# EAGLE design ALIMENTATION (EAGLE 8.5.1)
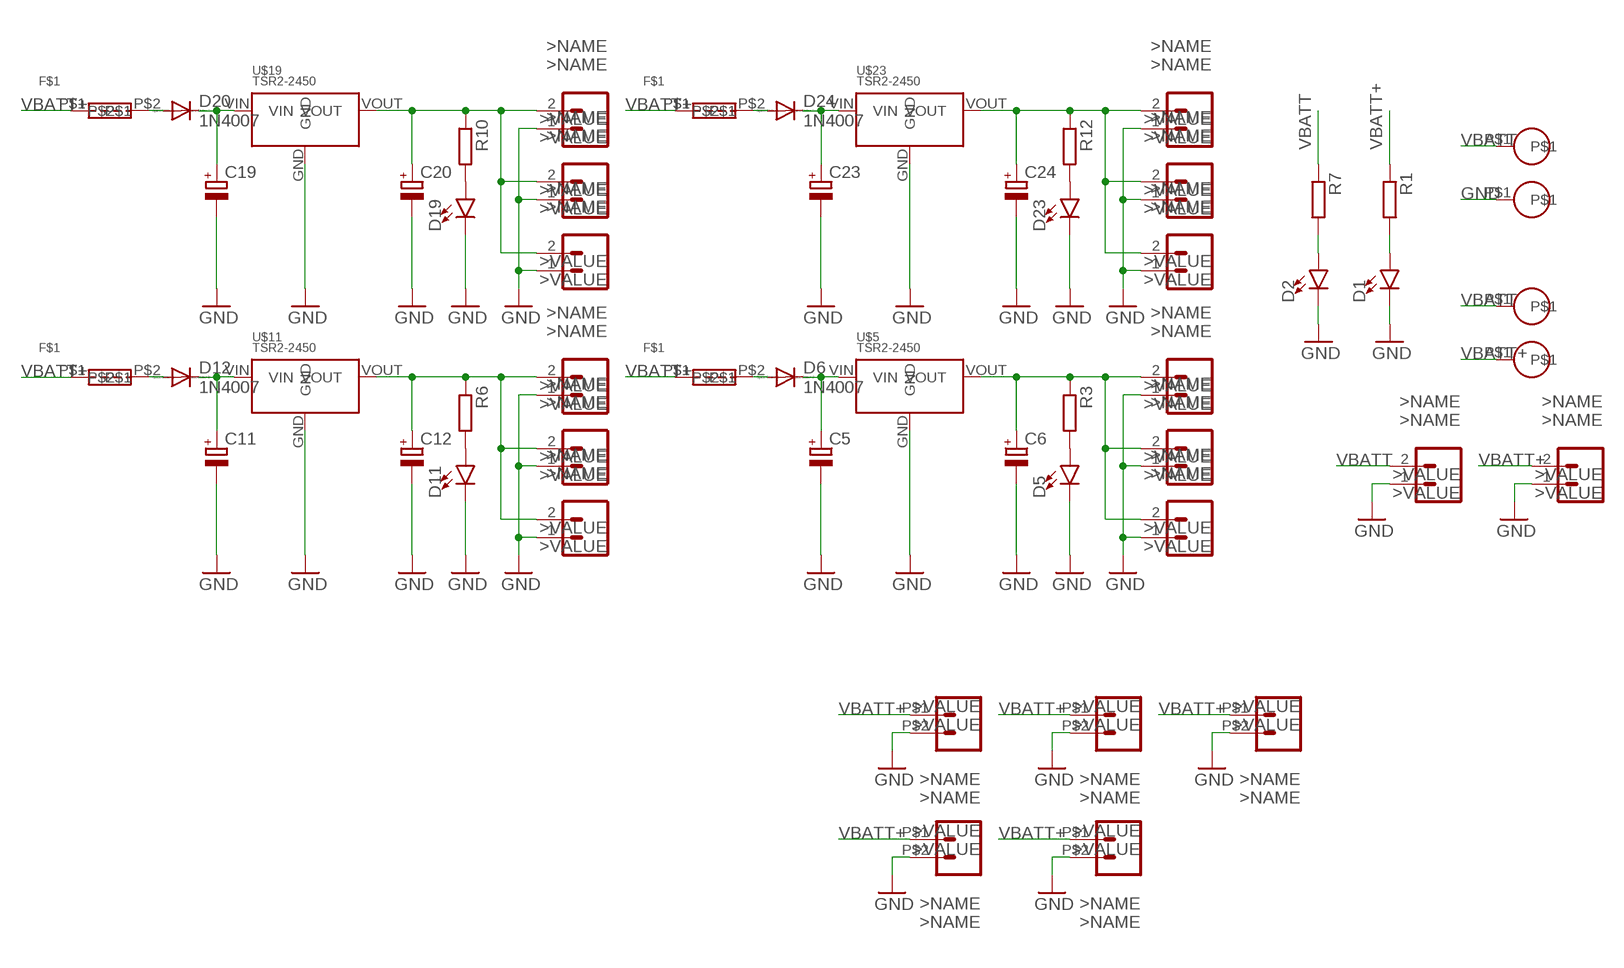
[diagram p0: schematic, sheet 1]

## Parts
C5  CPOL-EUE2-5  [E2-5]
C6  CPOL-EUE2-5  [E2-5]
C11  CPOL-EUE2-5  [E2-5]
C12  CPOL-EUE2-5  [E2-5]
C19  CPOL-EUE2-5  [E2-5]
C20  CPOL-EUE2-5  [E2-5]
C23  CPOL-EUE2-5  [E2-5]
C24  CPOL-EUE2-5  [E2-5]
D1  LED3MM  [LED_3MM]
D2  LED3MM  [LED_3MM]
D5  LED3MM  [LED_3MM]
D6  1N4007  1N4004  [DO41-10]
D11  LED3MM  [LED_3MM]
D12  1N4007  1N4004  [DO41-10]
D19  LED3MM  [LED_3MM]
D20  1N4007  1N4004  [DO41-10]
D23  LED3MM  [LED_3MM]
D24  1N4007  1N4004  [DO41-10]
J1  CONN_02POLAR  [MOLEX-1X2]
J2  CONN_02POLAR  [MOLEX-1X2]
J3  CONN_027A-C  [NSK396-2C]
J7  CONN_02POLAR  [MOLEX-1X2]
J8  CONN_02POLAR  [MOLEX-1X2]
J9  CONN_02POLAR  [MOLEX-1X2]
J10  CONN_027A-C  [NSK396-2C]
J11  CONN_027A-C  [NSK396-2C]
J12  CONN_027A-C  [NSK396-2C]
J13  CONN_027A-C  [NSK396-2C]
J16  CONN_02POLAR  [MOLEX-1X2]
J17  CONN_02POLAR  [MOLEX-1X2]
J18  CONN_02POLAR  [MOLEX-1X2]
J28  CONN_02POLAR  [MOLEX-1X2]
J29  CONN_02POLAR  [MOLEX-1X2]
J30  CONN_02POLAR  [MOLEX-1X2]
J34  CONN_02POLAR  [MOLEX-1X2]
J35  CONN_02POLAR  [MOLEX-1X2]
J36  CONN_02POLAR  [MOLEX-1X2]
R1  R-EU_0204/2V  [0204V]
R3  R-EU_0204/2V  [0204V]
R6  R-EU_0204/2V  [0204V]
R7  R-EU_0204/2V  [0204V]
R10  R-EU_0204/2V  [0204V]
R12  R-EU_0204/2V  [0204V]
U$1  BATTERY_PAD  [BATTERY_PAD]
U$2  BATTERY_PAD  [BATTERY_PAD]
U$5  TSR2-2450  [TSR2-2450]
U$6  RUEF_POLY  [RUEF185]
U$11  TSR2-2450  [TSR2-2450]
U$12  RUEF_POLY  [RUEF185]
U$13  BATTERY_PAD  [BATTERY_PAD]
U$14  BATTERY_PAD  [BATTERY_PAD]
U$19  TSR2-2450  [TSR2-2450]
U$20  RUEF_POLY  [RUEF185]
U$23  TSR2-2450  [TSR2-2450]
U$24  RUEF_POLY  [RUEF185]

## Nets
GND: C5.- C6.- C11.- C12.- C19.- C20.- C23.- C24.- D1.K(C) D2.K(C) D5.K(C) D11.K(C) D19.K(C) D23.K(C) J1.1 J2.1 J3.P$2 J7.1 J8.1 J9.1 J10.P$2 J11.P$2 J12.P$2 J13.P$2 J16.1 J17.1 J18.1 J28.1 J29.1 J30.1 J34.1 J35.1 J36.1 U$2.P$1 U$5.GND U$11.GND U$19.GND U$23.GND
N$1: D1.A R1.2
N$2: D2.A R7.2
N$9: C6.+ J7.2 J8.2 J9.2 R3.1 U$5.VOUT
N$10: D5.A R3.2
N$11: C5.+ D6.C U$5.VIN
N$12: D6.A U$6.P$2
N$21: C12.+ J16.2 J17.2 J18.2 R6.1 U$11.VOUT
N$22: D11.A R6.2
N$23: C11.+ D12.C U$11.VIN
N$24: D12.A U$12.P$2
N$37: C20.+ J28.2 J29.2 J30.2 R10.1 U$19.VOUT
N$38: D19.A R10.2
N$39: C19.+ D20.C U$19.VIN
N$40: D20.A U$20.P$2
N$45: C24.+ J34.2 J35.2 J36.2 R12.1 U$23.VOUT
N$46: D23.A R12.2
N$47: C23.+ D24.C U$23.VIN
N$48: D24.A U$24.P$2
VBATT: J1.2 R7.1 U$1.P$1 U$13.P$1
VBATT+: J2.2 J3.P$1 J10.P$1 J11.P$1 J12.P$1 J13.P$1 R1.1 U$6.P$1 U$12.P$1 U$14.P$1 U$20.P$1 U$24.P$1

## Library data of the parts
C5 C6 C11 C12 C19 C20 C23 C24 = rcl:CPOL-EU: POLARIZED CAPACITOR, European symbol
D1 D2 D5 D11 D19 D23 = OPENBOT:LED: LED (Generic) Standard schematic elements and footprints for 5mm, 3mm, 1206, and 0603 sized LEDs. Generic LEDs with no color specified.; PROD_ID: DIO-08794
D6 D12 D20 D24 = diode:1N4004: DIODE general purpose rectifier, 1 A
J1 J2 J7-J9 J16-J18 J28-J30 J34-J36 = OPENBOT:CONN_02: Multi connection point. Often used as Generic Header-pin footprint for 0.1 inch spaced/style header connections On any of the 0.1 inch spaced packages, you can populate with these: Break Away Headers - Straight <https://www.sparkfun.com/products/116> (PRT-00116) Break Away Male Headers - Right Angle <https://www.sparkfun.com/products/553> (PRT-00553) Female Headers <https://www.sparkfun.com/products/115> (PRT-00115) Break Away Headers - Machine Pin <https://www.sparkfun.com/products/117> (PRT-00117) Break Away Female Headers - Swiss Machine Pin <https://www.sparkfun.com/products/743> (PRT-00743) For SCREWTERMINALS and SPRING TERMINALS visit here: Screw Terimnals on SparkFun.com <https://www.sparkfun.com/search/results?term=Screw+Terminals> (5mm/3.5mm/2.54mm spacing) This device is also useful as a general connection point to wire up your design to another part of your project. Our various solder wires solder well into these plated through hole pads. Hook-Up Wire - Assortment (Stranded, 22 AWG) <https://www.sparkfun.com/products/11375> (PRT-11375) Hook-Up Wire - Assortment (Solid Core, 22 AWG) <https://www.sparkfun.com/products/11367> (PRT-11367) View the entire wire category on our website here <https://www.sparkfun.com/categories/141> Special notes: Molex polarized connector foot print use with: PRT-08233 with associated crimp pins and housings. 2.54_SCREWTERM for use with PRT-10571. 3.5mm Screw Terminal footprints for PRT-08084 5mm Screw Terminal footprints for use with PRT-08432 Multi connection point. Often used as Generic Header-pin footprint for 0.1 inch spaced/style header connections On any of the 0.1 inch spaced packages, you can populate with these: Break Away Headers - Straight <https://www.sparkfun.com/products/116> (PRT-00116) Break Away Male Headers - Right Angle <https://www.sparkfun.com/products/553> (PRT-00553) Female Headers <https://www.sparkfun.com/products/115> (PRT-00115) Break Away Headers - Machine Pin <https://www.sparkfun.com/products/117> (PRT-00117) Break Away Female Headers - Swiss Machine Pin <https://www.sparkfun.com/products/743> (PRT-00743) For SCREWTERMINALS and SPRING TERMINALS visit here: Screw Terimnals on SparkFun.com <https://www.sparkfun.com/search/results?term=Screw+Terminals> (5mm/3.5mm/2.54mm spacing) This device is also useful as a general connection point to wire up your design to another part of your project. Our various solder wires solder well into these plated through hole pads. Hook-Up Wire - Assortment (Stranded, 22 AWG) <https://www.sparkfun.com/products/11375> (PRT-11375) Hook-Up Wire - Assortment (Solid Core, 22 AWG) <https://www.sparkfun.com/products/11367> (PRT-11367) View the entire wire category on our website here <https://www.sparkfun.com/categories/141> Special notes: Molex polarized connector foot print use with: PRT-08233 with associated crimp pins and housings. 2.54_SCREWTERM for use with PRT-10571. 3.5mm Screw Terminal footprints for PRT-08084 5mm Screw Terminal footprints for use with PRT-08432; SF_ID: PRT-09918
J3 J10-J13 = OPENBOT:CONN_02: Multi connection point. Often used as Generic Header-pin footprint for 0.1 inch spaced/style header connections On any of the 0.1 inch spaced packages, you can populate with these: Break Away Headers - Straight <https://www.sparkfun.com/products/116> (PRT-00116) Break Away Male Headers - Right Angle <https://www.sparkfun.com/products/553> (PRT-00553) Female Headers <https://www.sparkfun.com/products/115> (PRT-00115) Break Away Headers - Machine Pin <https://www.sparkfun.com/products/117> (PRT-00117) Break Away Female Headers - Swiss Machine Pin <https://www.sparkfun.com/products/743> (PRT-00743) For SCREWTERMINALS and SPRING TERMINALS visit here: Screw Terimnals on SparkFun.com <https://www.sparkfun.com/search/results?term=Screw+Terminals> (5mm/3.5mm/2.54mm spacing) This device is also useful as a general connection point to wire up your design to another part of your project. Our various solder wires solder well into these plated through hole pads. Hook-Up Wire - Assortment (Stranded, 22 AWG) <https://www.sparkfun.com/products/11375> (PRT-11375) Hook-Up Wire - Assortment (Solid Core, 22 AWG) <https://www.sparkfun.com/products/11367> (PRT-11367) View the entire wire category on our website here <https://www.sparkfun.com/categories/141> Special notes: Molex polarized connector foot print use with: PRT-08233 with associated crimp pins and housings. 2.54_SCREWTERM for use with PRT-10571. 3.5mm Screw Terminal footprints for PRT-08084 5mm Screw Terminal footprints for use with PRT-08432 Multi connection point. Often used as Generic Header-pin footprint for 0.1 inch spaced/style header connections On any of the 0.1 inch spaced packages, you can populate with these: Break Away Headers - Straight <https://www.sparkfun.com/products/116> (PRT-00116) Break Away Male Headers - Right Angle <https://www.sparkfun.com/products/553> (PRT-00553) Female Headers <https://www.sparkfun.com/products/115> (PRT-00115) Break Away Headers - Machine Pin <https://www.sparkfun.com/products/117> (PRT-00117) Break Away Female Headers - Swiss Machine Pin <https://www.sparkfun.com/products/743> (PRT-00743) For SCREWTERMINALS and SPRING TERMINALS visit here: Screw Terimnals on SparkFun.com <https://www.sparkfun.com/search/results?term=Screw+Terminals> (5mm/3.5mm/2.54mm spacing) This device is also useful as a general connection point to wire up your design to another part of your project. Our various solder wires solder well into these plated through hole pads. Hook-Up Wire - Assortment (Stranded, 22 AWG) <https://www.sparkfun.com/products/11375> (PRT-11375) Hook-Up Wire - Assortment (Solid Core, 22 AWG) <https://www.sparkfun.com/products/11367> (PRT-11367) View the entire wire category on our website here <https://www.sparkfun.com/categories/141> Special notes: Molex polarized connector foot print use with: PRT-08233 with associated crimp pins and housings. 2.54_SCREWTERM for use with PRT-10571. 3.5mm Screw Terminal footprints for PRT-08084 5mm Screw Terminal footprints for use with PRT-08432
R1 R3 R6 R7 R10 R12 = rcl:R-EU_: RESISTOR, European symbol
U$1 U$2 U$13 U$14 = OPENBOT:BATTERY_PAD
U$5 U$11 U$19 U$23 = OPENBOT:TSR2-2450
U$6 U$12 U$20 U$24 = OPENBOT:RUEF_POLY

## Board
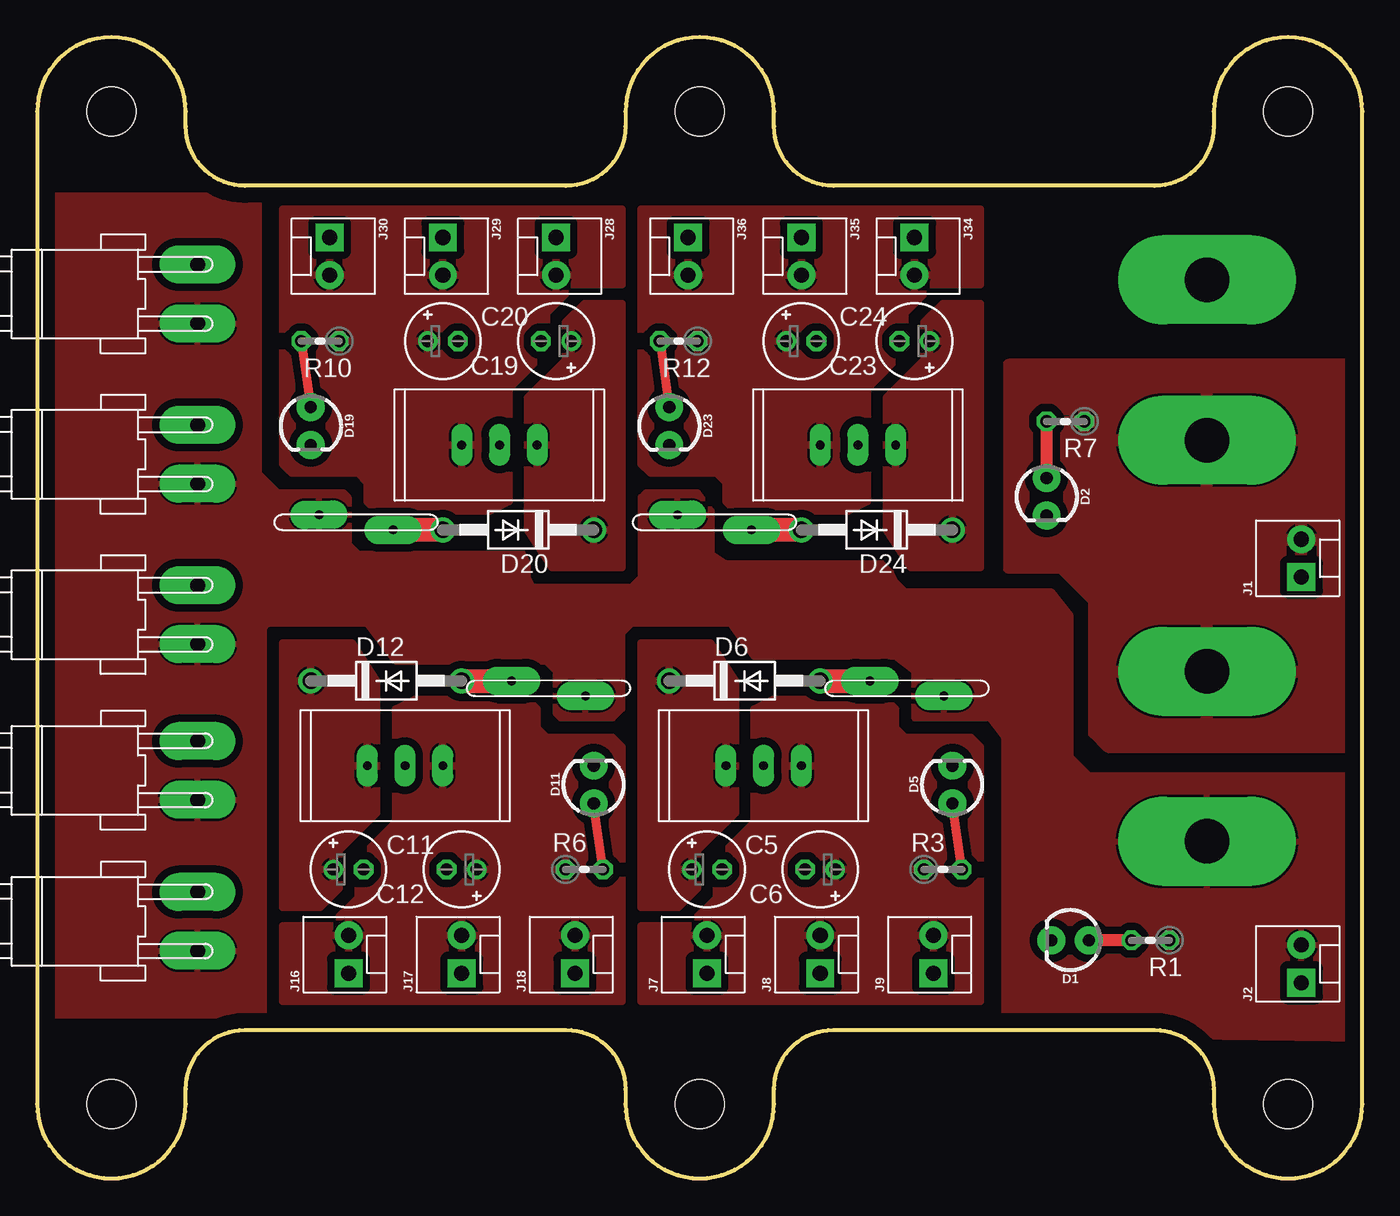
[diagram p1: board, top side]
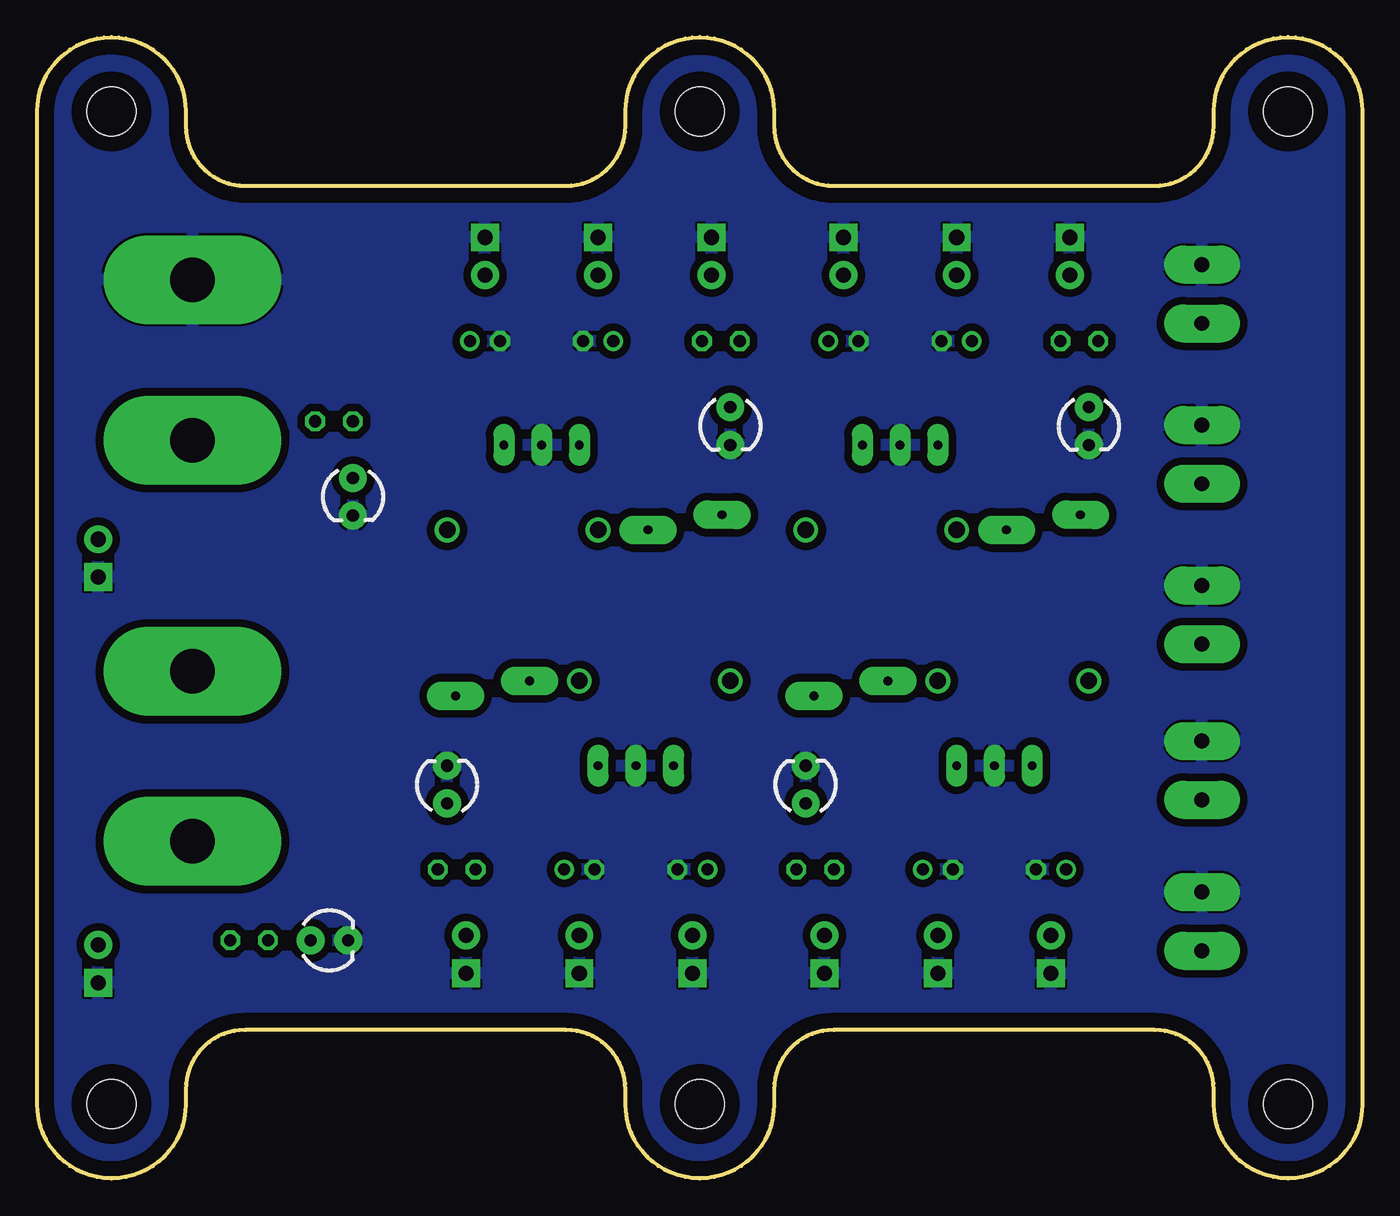
[diagram p2: board, bottom side, seen from below]

Size 89.2 x 76.82 mm. Coordinates in mm from the lower left corner, seen from the top.
Outline: 0,71.82 0,5 arc180 10,5 10,6 arc-90 14,10 35.6,10 arc-90 39.6,6 39.6,5 arc180 49.6,5 49.6,6 arc-90 53.6,10 75.2,10 arc-90 79.2,6 79.2,5 arc180 89.2,5 89.2,71.82 arc180 79.2,71.82 79.2,70.82 arc-90 75.2,66.82 53.6,66.82 arc-90 49.6,70.82 49.6,71.82 arc180 39.6,71.82 39.6,70.82 arc-90 35.6,66.82 14,66.82 arc-90 10,70.82 10,71.82 arc180 0,71.82
Copper layers (1*16): Top 0.035mm / dielectric 1.5mm / Bottom 0.035mm
Design rules "default *": minimum track width 6mil, minimum drill 0.35mm, track to track 20mil, track to pad 20mil, pad to pad 20mil, via to via 20mil, smd to smd 6mil, copper to edge 40mil, drill to drill 6mil, minimum pad ring 10mil, minimum via ring 8mil, stop-mask expansion 4mil, vias tented up to drill 0mil, thermal gap 6mil
Holes 3.3 mm at 5,5 84.2,71.82 44.6,5 84.2,5 44.6,71.82 5,71.82

### Footprints (pad centres in the part's own frame; a part is rotated, then mirrored left to right if it is on the bottom)
E2-5 = drill 0.813 pad 1.27: + -1.016,0 | drill 0.813 pad 1.27 octagon: - 1.016,0
LED_3MM = drill 0.813 pad 1.88: A -1.27,0; K 1.27,0
DO41-10 = drill 1.118: A 5.08,0; C -5.08,0
MOLEX-1X2 = drill 1.016 pad 1.88 square: 1 0,0 | drill 1.016 pad 1.88: 2 2.54,0
NSK396-2C = drill 1 pad 2.54 long: P$1 -1.98,0; P$2 1.98,0
0204V = drill 0.813 octagon: 1 -1.27,0; 2 1.27,0
BATTERY_PAD = drill 3 pad 6 long: P$1 0,0
TSR2-2450 = drill 0.6 pad 1.422 long: GND 0,0; VIN -2.54,0; VOUT 2.54,0
RUEF185 = drill 0.6 pad 1.93 long: P$1 -2.54,0; P$2 2.54,0

### Placement (x,y rotation side)
C5  45.09,20.8 0 top
C6  52.7,20.8 180 top
C11  20.95,20.8 0 top
C12  28.57,20.8 180 top
C19  34.92,56.35 180 top
C20  27.3,56.35 0 top
C23  59.05,56.35 180 top
C24  51.44,56.35 0 top
D1  69.53,16.03 180 top
D2  67.94,45.88 270 top
D5  61.59,26.51 90 top
D6  47.62,33.5 0 top
D11  37.47,26.51 90 top
D12  23.5,33.5 0 top
D19  18.41,50.64 270 top
D20  32.38,43.66 180 top
D23  42.55,50.64 270 top
D24  56.52,43.66 180 top
J1  85.09,40.48 90 top
J2  85.09,13.18 90 top
J3  10.79,59.53 90 top
J7  45.09,13.81 90 top
J8  52.7,13.81 90 top
J9  60.33,13.81 90 top
J10  10.79,17.3 90 top
J11  10.79,48.73 90 top
J12  10.79,37.94 90 top
J13  10.79,27.46 90 top
J16  20.95,13.81 90 top
J17  28.57,13.81 90 top
J18  36.2,13.81 90 top
J28  34.92,63.34 270 top
J29  27.3,63.34 270 top
J30  19.68,63.34 270 top
J34  59.05,63.34 270 top
J35  51.44,63.34 270 top
J36  43.81,63.34 270 top
R1  74.93,16.03 180 top
R3  60.96,20.8 0 top
R6  36.83,20.8 0 top
R7  69.22,50.96 180 top
R10  19.05,56.35 180 top
R12  43.18,56.35 180 top
U$1  78.74,49.69 180 top
U$2  78.74,60.48 180 top
U$5  48.9,27.78 0 top
U$6  58.55,32.99 168.5 top
U$11  24.77,27.78 0 top
U$12  34.42,32.99 168.5 top
U$13  78.74,34.13 0 top
U$14  78.74,22.7 0 top
U$19  31.11,49.37 180 top
U$20  21.46,44.16 348.5 top
U$23  55.24,49.37 180 top
U$24  45.59,44.16 348.5 top

### Tracks (layer width: path | path; a pad name or v marks a point on that pad's centre or on a via)
GND
  pour Bottom: -0.64,78.58 90.81,78.26 90.81,-1.75 -0.64,-1.43
N$1
  Top 0.813: R1.2 D1.A
N$2
  Top 0.813: R7.2 D2.A
N$9
  pour Top: 40.64,11.9 40.64,16.98 43.81,16.98 45.72,18.89 45.72,21.43 48.26,23.97 48.26,31.59 49.53,32.23 57.15,32.23 57.78,31.59 57.78,30.32 58.42,29.68 62.87,29.68 63.5,29.05 63.5,11.9
N$10
  Top 0.61: R3.2 D5.A
N$11
  pour Top: 40.64,36.03 45.34,36.03 46.99,33.5 46.99,24.61 44.45,22.06 44.45,19.52 43.18,18.26 40.64,18.26
N$12
  Top 1.626: D6.A U$6.P$2
N$21
  pour Top: 16.51,11.9 16.51,16.98 19.68,16.98 21.59,18.89 21.59,21.43 24.13,23.97 24.13,31.59 25.4,32.23 33.02,32.23 33.66,31.59 33.66,30.32 34.29,29.68 38.73,29.68 39.37,29.05 39.37,11.9
N$22
  Top 0.61: R6.2 D11.A
N$23
  pour Top: 16.51,36.03 21.21,36.03 22.86,33.5 22.86,24.61 20.32,22.06 20.32,19.52 19.05,18.26 16.51,18.26
N$24
  Top 1.626: D12.A U$12.P$2
N$37
  pour Top: 39.37,65.25 39.37,60.16 36.2,60.16 34.29,58.26 34.29,55.72 31.75,53.18 31.75,45.56 30.48,44.92 22.86,44.92 22.23,45.56 22.23,46.83 21.59,47.47 17.14,47.47 16.51,48.1 16.51,65.25
N$38
  Top 0.61: R10.2 D19.A
N$39
  pour Top: 39.37,41.11 34.67,41.11 33.02,43.66 33.02,52.55 35.56,55.09 35.56,57.62 36.83,58.9 39.37,58.9
N$40
  Top 1.626: D20.A U$20.P$2
N$45
  pour Top: 63.5,65.25 63.5,60.16 60.33,60.16 58.42,58.26 58.42,55.72 55.88,53.18 55.88,45.56 54.61,44.92 46.99,44.92 46.35,45.56 46.35,46.83 45.72,47.47 41.27,47.47 40.64,48.1 40.64,65.25
N$46
  Top 0.61: R12.2 D23.A
N$47
  pour Top: 63.5,41.11 58.8,41.11 57.15,43.66 57.15,52.55 59.69,55.09 59.69,57.62 60.96,58.9 63.5,58.9
N$48
  Top 1.626: D24.A U$24.P$2
VBATT
  pour Top: 72.07,29.05 89.85,29.05 89.85,54.77 65.41,54.77 65.41,41.11 68.9,41.11 71.12,38.89 71.12,30
VBATT+
  pour Top: 15.24,10.95 0.95,10.95 0.95,66.2 14.29,66.2 14.92,65.88 14.92,47.47 16.19,46.2 20.64,46.2 20.95,45.88 20.95,42.7 21.59,42.07 32.7,42.07 33.02,41.43 33.02,40.48 33.34,39.84 40.01,39.84 40.64,40.48 40.64,45.88 40.96,46.2 44.45,46.2 45.4,44.92 45.4,42.07 46.35,41.43 56.83,41.43 57.47,40.8 57.78,40.16 58.42,39.53 68.26,39.53 69.53,37.94 69.53,28.41 70.8,27.14 89.85,27.14 89.53,9.37 65.09,9.68 65.09,29.68 64.14,30.95 59.05,30.95 59.05,34.13 57.78,35.08 48.26,35.08 46.67,37.3 40.01,37.3 39.37,36.67 39.37,31.59 38.73,30.95 35.24,30.95 34.92,31.27 34.92,34.13 34.29,34.77 24.13,34.77 22.23,37.3 15.56,37.3 15.24,36.99